# EAGLE schematic trans_vi_char (EAGLE 6.5.0)
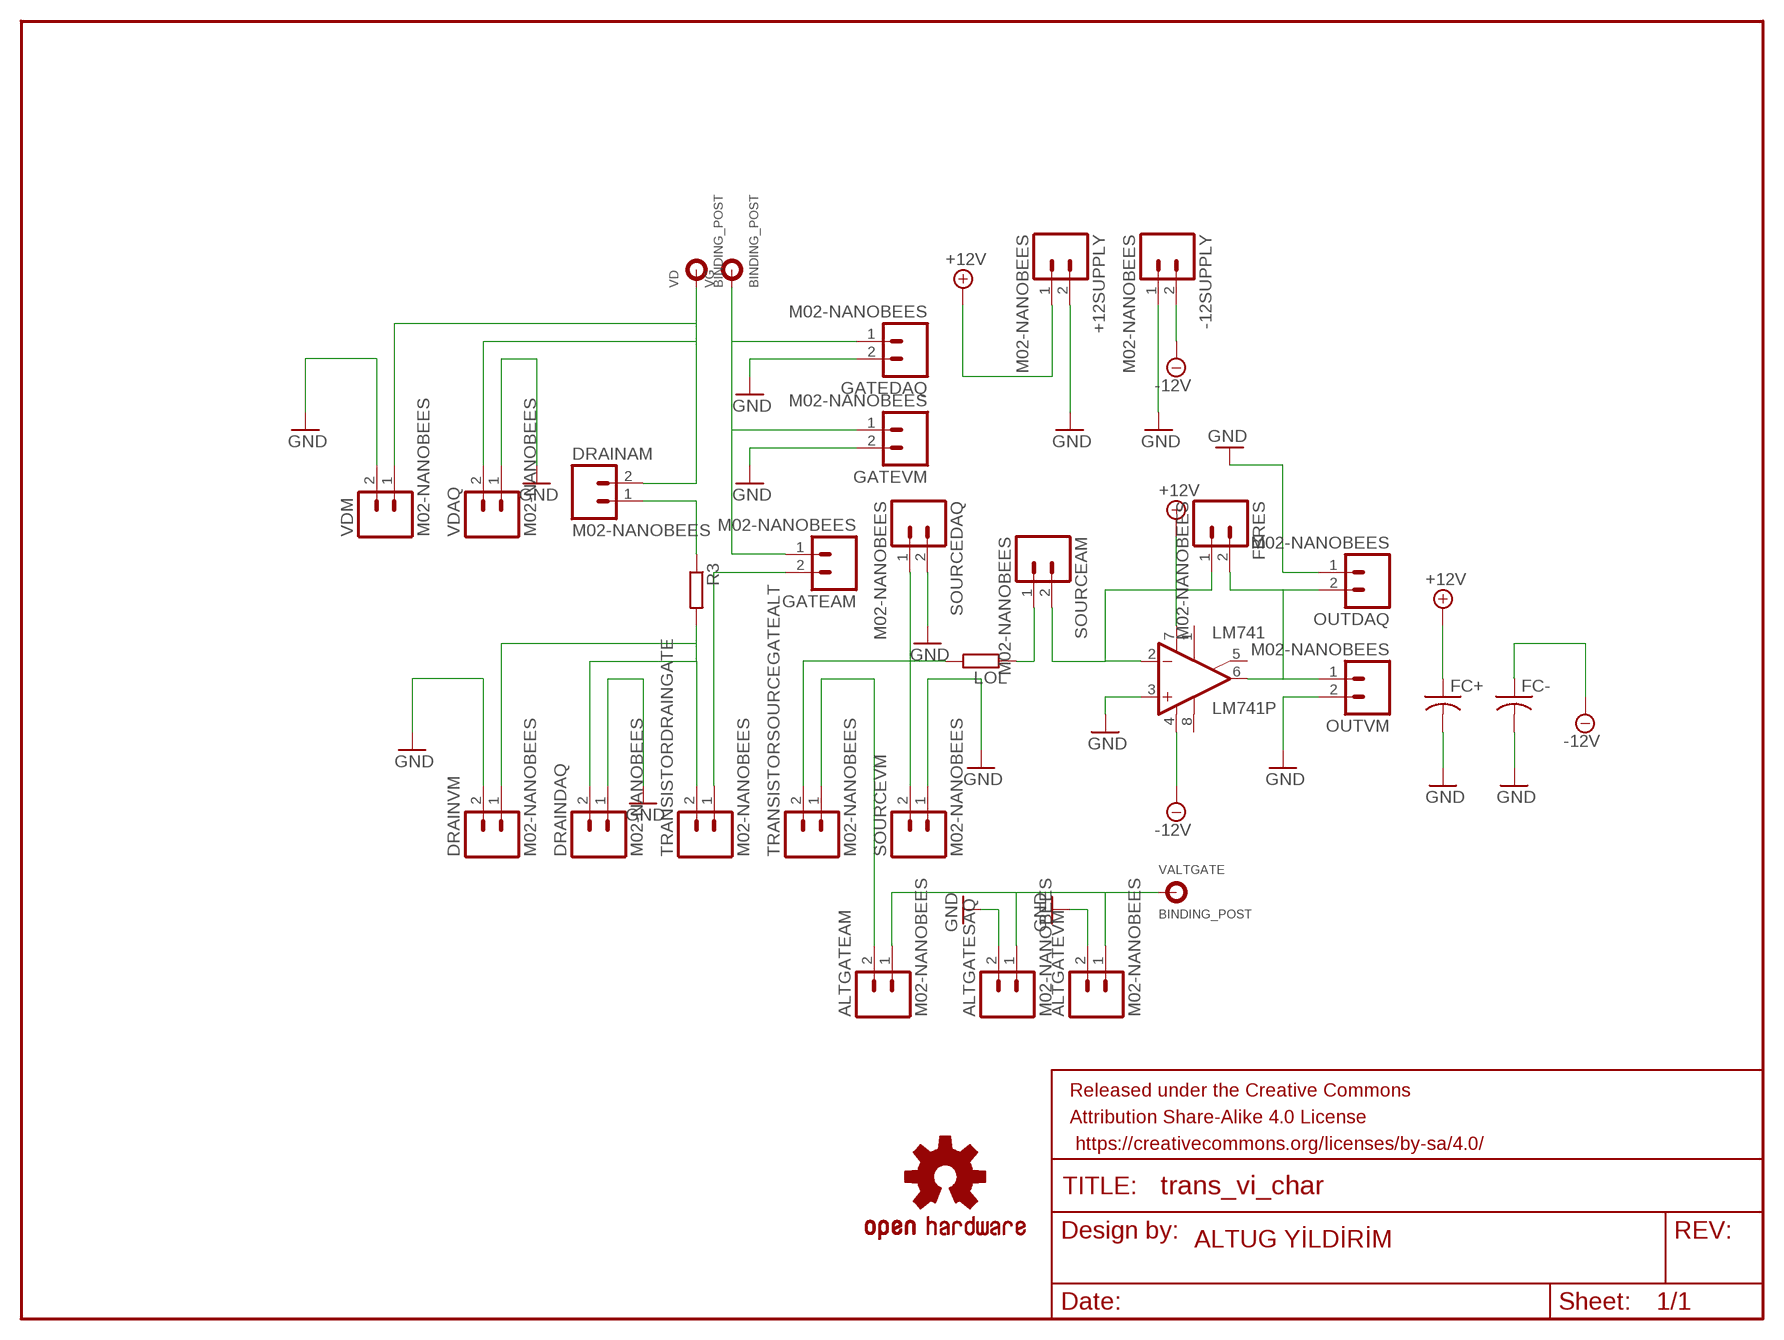
[diagram p0: schematic, sheet 1]

## Parts
+12SUPPLY  M02-NANOBEES  [M02-NANOBEES]
-12SUPPLY  M02-NANOBEES  [M02-NANOBEES]
ALTGATEAM  M02-NANOBEES  [M02-NANOBEES]
ALTGATESAQ  M02-NANOBEES  [M02-NANOBEES]
ALTGATEVM  M02-NANOBEES  [M02-NANOBEES]
DRAINAM  M02-NANOBEES  [M02-NANOBEES]
DRAINDAQ  M02-NANOBEES  [M02-NANOBEES]
DRAINVM  M02-NANOBEES  [M02-NANOBEES]
FBRES  M02-NANOBEES  [M02-NANOBEES]
FC+  C-US025-025X050  [C025-025X050]
FC-  C-US025-025X050  [C025-025X050]
FRAME1  FRAME-LETTER  [CREATIVE_COMMONS]
GATEAM  M02-NANOBEES  [M02-NANOBEES]
GATEDAQ  M02-NANOBEES  [M02-NANOBEES]
GATEVM  M02-NANOBEES  [M02-NANOBEES]
LM741  LM741P  [DIL08]
LOGO1  OSHW-LOGOM  [OSHW-LOGO-M]
LOL  R-EU_0204/7  [0204/7]
OUTDAQ  M02-NANOBEES  [M02-NANOBEES]
OUTVM  M02-NANOBEES  [M02-NANOBEES]
R3  R-EU_0204/7  [0204/7]
SOURCEAM  M02-NANOBEES  [M02-NANOBEES]
SOURCEDAQ  M02-NANOBEES  [M02-NANOBEES]
SOURCEVM  M02-NANOBEES  [M02-NANOBEES]
TRANSISTORDRAINGATE  M02-NANOBEES  [M02-NANOBEES]
TRANSISTORSOURCEGATEALT  M02-NANOBEES  [M02-NANOBEES]
VALTGATE  BINDING_POST  [BINDING_POST]
VD  BINDING_POST  [BINDING_POST]
VDAQ  M02-NANOBEES  [M02-NANOBEES]
VDM  M02-NANOBEES  [M02-NANOBEES]
VG  BINDING_POST  [BINDING_POST]

## Nets
+12V: +12SUPPLY.1 FC+.1 LM741.7(V+)
-12V: -12SUPPLY.2 FC-.1 LM741.4(V-)
GND: +12SUPPLY.2 -12SUPPLY.1 ALTGATESAQ.2 ALTGATEVM.2 DRAINDAQ.1 DRAINVM.2 FC+.2 FC-.2 GATEDAQ.2 GATEVM.2 LM741.3(-IN) OUTDAQ.1 OUTVM.2 SOURCEDAQ.2 SOURCEVM.1 VDAQ.1 VDM.2
N$1: FBRES.2 LM741.6(OUT) OUTDAQ.2 OUTVM.1
N$2: FBRES.1 LM741.2(+IN) SOURCEAM.2
N$3: DRAINDAQ.2 DRAINVM.1 R3.2 TRANSISTORDRAINGATE.2
N$4: LOL.2 SOURCEDAQ.1 SOURCEVM.2 TRANSISTORSOURCEGATEALT.2
N$5: DRAINAM.1 R3.1
N$6: ALTGATEAM.2 TRANSISTORSOURCEGATEALT.1
N$7: GATEAM.2 TRANSISTORDRAINGATE.1
N$8: GATEAM.1 GATEDAQ.1 GATEVM.1 VG.P$1
N$9: DRAINAM.2 VD.P$1 VDAQ.2 VDM.1
N$10: ALTGATEAM.1 ALTGATESAQ.1 ALTGATEVM.1 VALTGATE.P$1
N$11: LOL.1 SOURCEAM.1
Unconnected: LM741.1(ON1) LM741.5(ON2) LM741.8(OPT)

## Notes on the sheet
- ALTUG YİLDİRİM

## Library data of the parts
+12SUPPLY -12SUPPLY ALTGATEAM ALTGATESAQ ALTGATEVM DRAINAM DRAINDAQ DRAINVM FBRES GATEAM GATEDAQ GATEVM OUTDAQ OUTVM SOURCEAM SOURCEDAQ SOURCEVM TRANSISTORDRAINGATE TRANSISTORSOURCEGATEALT VDAQ VDM = SparkFun-Connectors:M02-NANOBEES
FC+ FC- = adafruit:C-US: CAPACITOR, American symbol
FRAME1 = SparkFun-Aesthetics:FRAME-LETTER: Schematic Frame Standard 8.5x11 US Letter frame
LM741 = linear:*741: OP AMP
LOGO1 = SparkFun-Aesthetics:OSHW-LOGO: Open Source Hardware Logo This logo indicates the piece of hardware it is found on incorporates a OSHW license and/or adheres to the definition of open source hardware found here: http://freedomdefined.org/OSHW
LOL R3 = resistor:R-EU_: RESISTOR, European symbol
VALTGATE VD VG = SparkFun-Connectors:BINDING_POST: Single Banana jack. PRT-09739 (red) or PRT-09740 (blk) Footprint is a bit strange. The component itself has an threaded, insulated body that goes through the board, with a small threaded metal stud coming off the back. The intent of this package is that the post goes through a milled obling hole, and a small wire would be used to connect from the PCB pad to the metal contact on the post.